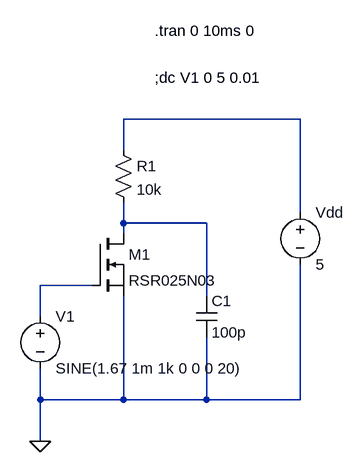
[diagram p0: schematic priklad2.asc]
priklad2.asc, the LTspice schematic file:
Version 4
SHEET 1 880 680
WIRE 192 -256 -80 -256
WIRE -80 -208 -80 -256
WIRE 192 -112 192 -256
WIRE -80 -96 -80 -128
WIRE 48 -96 -80 -96
WIRE -80 -80 -80 -96
WIRE -128 0 -208 0
WIRE 48 16 48 -96
WIRE -208 48 -208 0
WIRE -208 176 -208 128
WIRE -80 176 -80 16
WIRE -80 176 -208 176
WIRE 48 176 48 80
WIRE 48 176 -80 176
WIRE 192 176 192 -32
WIRE 192 176 48 176
WIRE -208 240 -208 176
FLAG -208 240 0
SYMBOL voltage -208 32 R0
WINDOW 123 0 0 Left 2
WINDOW 39 0 0 Left 2
SYMATTR InstName V1
SYMATTR Value SINE(1.67 1m 1k 0 0 0 20)
SYMBOL voltage 192 -128 R0
WINDOW 123 0 0 Left 2
WINDOW 39 0 0 Left 2
SYMATTR InstName Vdd
SYMATTR Value 5
SYMBOL res -96 -224 R0
SYMATTR InstName R1
SYMATTR Value 10k
SYMBOL cap 32 16 R0
SYMATTR InstName C1
SYMATTR Value 100p
SYMBOL nmos -128 -80 R0
SYMATTR InstName M1
SYMATTR Value RSR025N03
TEXT -32 -320 Left 2 !;dc V1 0 5 0.01
TEXT -32 -392 Left 2 !.tran 0 10ms 0

The netlist it stands for:
* priklad2.asc
V1 N003 0 SINE(1.67 1m 1k 0 0 0 20)
Vdd N001 0 5
R1 N001 N002 10k
C1 N002 0 100p
M1 N002 N003 0 0 RSR025N03
.model NMOS NMOS
.model PMOS PMOS
.lib standard.mos
;dc V1 0 5 0.01
.tran 0 10ms 0
.backanno
.end